# EAGLE design temp indicator (EAGLE 9.0.0)
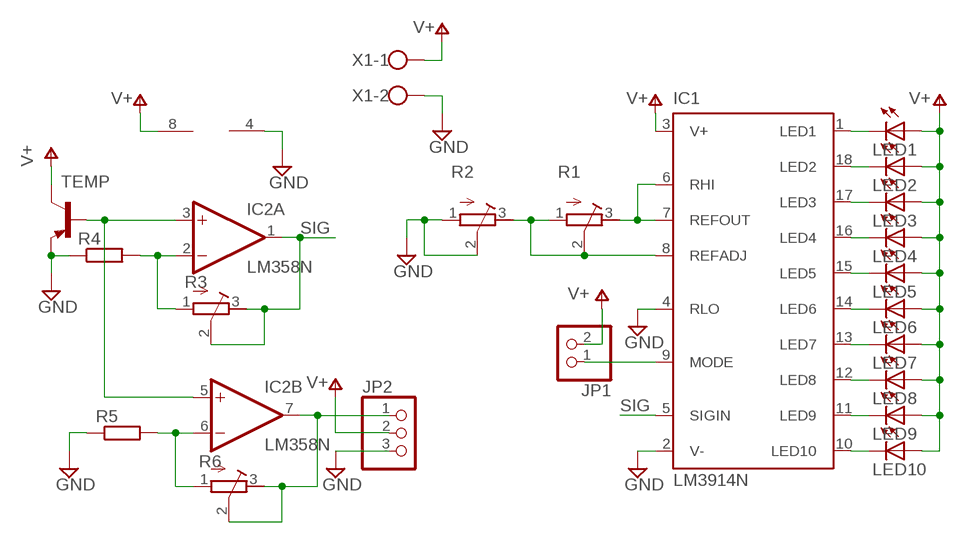
[diagram p0: schematic, sheet 1]

## Parts
IC1  LM3914N  [DIL18]
IC2  LM358N  [DIL08]
JP1  PINHD-1X2  [1X02]
JP2  PINHD-1X3  [1X03]
LED1  LED5MM  [LED5MM]
LED2  LED5MM  [LED5MM]
LED3  LED5MM  [LED5MM]
LED4  LED5MM  [LED5MM]
LED5  LED5MM  [LED5MM]
LED6  LED5MM  [LED5MM]
LED7  LED5MM  [LED5MM]
LED8  LED5MM  [LED5MM]
LED9  LED5MM  [LED5MM]
LED10  LED5MM  [LED5MM]
R1  R-TRIMM64W  [RTRIM64W]
R2  R-TRIMM64W  [RTRIM64W]
R3  R-TRIMM64W  [RTRIM64W]
R4  R-EU_0207/10  [0207/10]
R5  R-EU_0207/10  [0207/10]
R6  R-TRIMM64W  [RTRIM64W]
TEMP  BC557  [TO92-EBC]
X1  W237-102  [W237-102]

## Nets
GND: IC1.2(V-) IC1.4(RLO) IC2.4(P:V-) JP2.3 R2.1(A) R2.2(S) R4.1 R5.1 TEMP.E X1.2
N$1: IC1.1(LED1) LED1.K(C)
N$2: IC1.18(LED2) LED2.K(C)
N$3: IC1.17(LED3) LED3.K(C)
N$4: IC1.16(LED4) LED4.K(C)
N$5: IC1.15(LED5) LED5.K(C)
N$6: IC1.14(LED6) LED6.K(C)
N$7: IC1.13(LED7) LED7.K(C)
N$8: IC1.12(LED8) LED8.K(C)
N$9: IC1.11(LED9) LED9.K(C)
N$10: IC1.10(LED10) LED10.K(C)
N$11: IC1.6(RHI) IC1.7(REFOUT) R1.3(E)
N$12: IC1.9(MODE) JP1.1
N$13: IC1.8(REFADJ) R1.1(A) R1.2(S) R2.3(E)
N$14: IC2.7(B:OUT) JP2.1 R6.2(S) R6.3(E)
N$15: IC2.3(A:+IN) IC2.5(B:+IN) TEMP.B
N$16: IC2.2(A:-IN) R3.1(A) R4.2
N$18: IC2.6(B:-IN) R5.2 R6.1(A)
SIG: IC1.5(SIGIN) IC2.1(A:OUT) R3.2(S) R3.3(E)
V+: IC1.3(V+) IC2.8(P:V+) JP1.2 JP2.2 LED1.A LED2.A LED3.A LED4.A LED5.A LED6.A LED7.A LED8.A LED9.A LED10.A TEMP.C X1.1

## Library data of the parts
IC1 = national-semiconductor:LM391: Dot/Bar Display Driver Source: Data sheet LM3915 <http://www.national.com/ds/LM/LM3915.pdf> Data sheet LM3914 <http://www.national.com/ds/LM/LM3914.pdf>
IC2 = linear:LM358: OP AMP also LM158; LM258; LM2904 Source: http://cache.national.com/ds/LM/LM158.pdf
JP1 = pinhead:PINHD-1X2: PIN HEADER
JP2 = pinhead:PINHD-1X3: PIN HEADER
LED1-LED10 = led:LED: LED OSRAM: - CHIPLED LG R971, LG N971, LY N971, LG Q971, LY Q971, LO R971, LY R971 LH N974, LH R974 LS Q976, LO Q976, LY Q976 LO Q996 - Hyper CHIPLED LW Q18S LB Q993, LB Q99A, LB R99A - SideLED LS A670, LO A670, LY A670, LG A670, LP A670 LB A673, LV A673, LT A673, LW A673 LH A674 LY A675 LS A676, LA A676, LO A676, LY A676, LW A676 LS A679, LY A679, LG A679 - Hyper Micro SIDELED® LS Y876, LA Y876, LO Y876, LY Y876 LT Y87S - SmartLED LW L88C, LW L88S LB L89C, LB L89S, LG L890 LS L89K, LO L89K, LY L89K LS L896, LA L896, LO L896, LY L896 - TOPLED LS T670, LO T670, LY T670, LG T670, LP T670 LSG T670, LSP T670, LSY T670, LOP T670, LYG T670 LG T671, LOG T671, LSG T671 LB T673, LV T673, LT T673, LW T673 LH T674 LS T676, LA T676, LO T676, LY T676, LB T676, LH T676, LSB T676, LW T676 LB T67C, LV T67C, LT T67C, LS T67K, LO T67K, LY T67K, LW E67C LS E67B, LA E67B, LO E67B, LY E67B, LB E67C, LV E67C, LT E67C LW T67C LS T679, LY T679, LG T679 LS T770, LO T770, LY T770, LG T770, LP T770 LB T773, LV T773, LT T773, LW T773 LH T774 LS E675, LA E675, LY E675, LS T675 LS T776, LA T776, LO T776, LY T776, LB T776 LHGB T686 LT T68C, LB T68C - Hyper Mini TOPLED® LB M676 - Mini TOPLED Santana® LG M470 LS M47K, LO M47K, LY M47K Source: http://www.osram.convergy.de LUXEON: - LUMILED® LXK2-PW12-R00, LXK2-PW12-S00, LXK2-PW14-U00, LXK2-PW14-V00 LXK2-PM12-R00, LXK2-PM12-S00, LXK2-PM14-U00 LXK2-PE12-Q00, LXK2-PE12-R00, LXK2-PE12-S00, LXK2-PE14-T00, LXK2-PE14-U00 LXK2-PB12-K00, LXK2-PB12-L00, LXK2-PB12-M00, LXK2-PB14-N00, LXK2-PB14-P00, LXK2-PB14-Q00 LXK2-PR12-L00, LXK2-PR12-M00, LXK2-PR14-Q00, LXK2-PR14-R00 LXK2-PD12-Q00, LXK2-PD12-R00, LXK2-PD12-S00 LXK2-PH12-R00, LXK2-PH12-S00 LXK2-PL12-P00, LXK2-PL12-Q00, LXK2-PL12-R00 Source: www.luxeon.com KINGBRIGHT: KA-3528ASYC Source: www.kingbright.com
R1-R3 R6 = rcl:R-TRIMM: Trimm resistor; SPICEMODEL: X; SPICEPREFIXL: POT
R4 R5 = resistor:R-EU_: RESISTOR, European symbol
TEMP = transistor-pnp:BC557*: PNP Transistror
X1 = con-wago-500:W237-102: WAGO SCREW CLAMP; MPN: 237-102; OC_FARNELL: unknown; OC_NEWARK: 70K9898

## Board
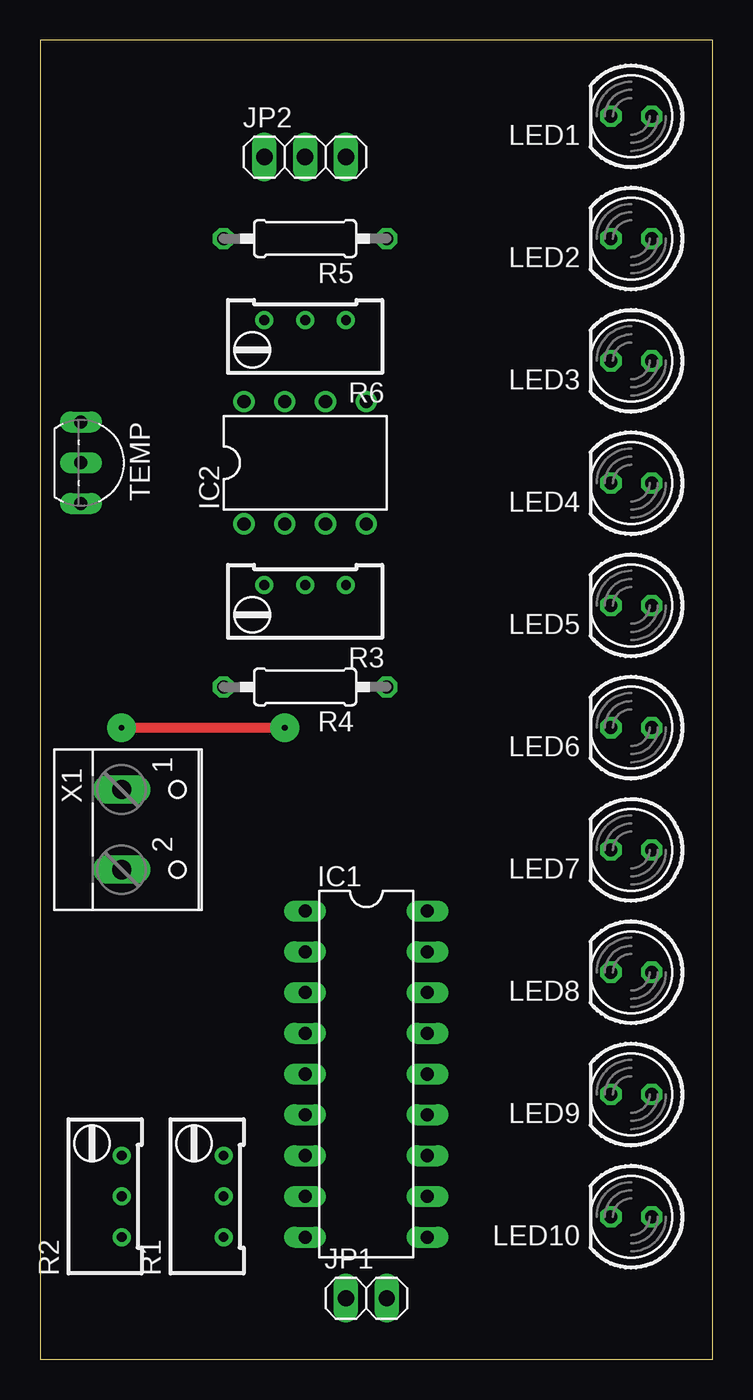
[diagram p1: board, top side]
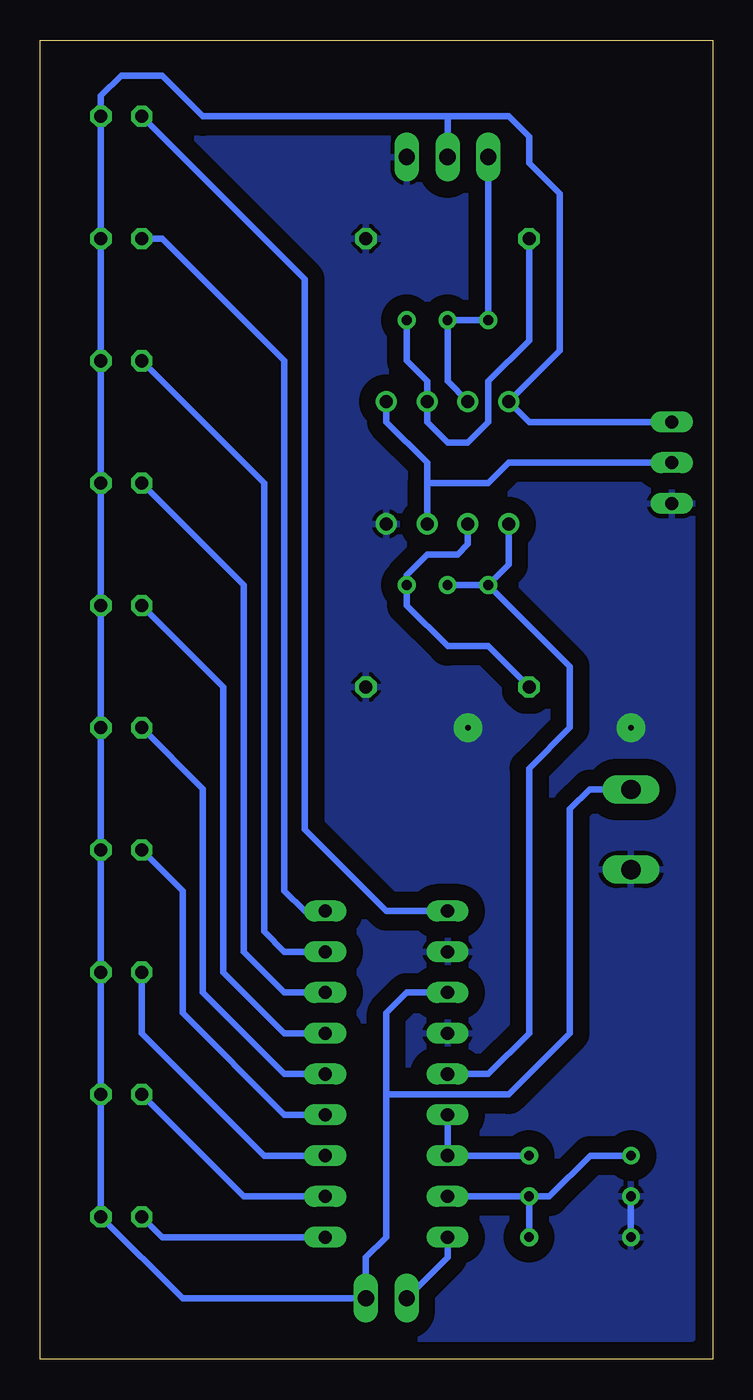
[diagram p2: board, bottom side, seen from below]

Size 41.89 x 82.22 mm. Coordinates in mm from the lower left corner, seen from the top.
Outline: 0,0 41.89,0 41.89,82.22 0,82.22 0,0
Copper layers (1*16): Top 0.035mm / dielectric 1.5mm / Bottom 0.035mm
Design rules "default": minimum track width 6mil, minimum drill 0.35mm, track to track 6mil, track to pad 6mil, pad to pad 6mil, via to via 6mil, smd to smd 6mil, copper to edge 40mil, drill to drill 6mil, minimum pad ring 10mil, minimum via ring 8mil, stop-mask expansion 4mil, vias tented up to drill 0mil, thermal gap 10mil

### Footprints (pad centres in the part's own frame; a part is rotated, then mirrored left to right if it is on the bottom)
DIL18 = drill 0.813 long: 1 -10.16,-3.81; 2 -7.62,-3.81; 3 -5.08,-3.81; 4 -2.54,-3.81; 5 0,-3.81; 6 2.54,-3.81; 7 5.08,-3.81; 8 7.62,-3.81; 9 10.16,-3.81; 10 10.16,3.81; 11 7.62,3.81; 12 5.08,3.81; 13 2.54,3.81; 14 0,3.81; 15 -2.54,3.81; 16 -5.08,3.81; 17 -7.62,3.81; 18 -10.16,3.81
DIL08 = drill 0.813 pad 1.27: 1 -3.81,-3.81; 2 -1.27,-3.81; 3 1.27,-3.81; 4 3.81,-3.81; 5 3.81,3.81; 6 1.27,3.81; 7 -1.27,3.81; 8 -3.81,3.81
1X02 = drill 1.016 long: 1 -1.27,0; 2 1.27,0
1X03 = drill 1.016 long: 1 -2.54,0; 2 0,0; 3 2.54,0
LED5MM = drill 0.813 octagon: A -1.27,0; K 1.27,0
RTRIM64W = drill 0.61: 1 1.27,-2.54; 2 1.27,0; 3 1.27,2.54
0207/10 = drill 0.813 octagon: 1 -5.08,0; 2 5.08,0
TO92-EBC = drill 0.813 long: B 0,-1.27; C -2.54,-1.27; E 2.54,-1.27
W237-102 = drill 1.194 long: 1 -2.5,-1.27; 2 2.5,-1.27

### Placement (x,y rotation side)
IC1  20.32,17.78 270 top
IC2  16.51,55.88 0 top
JP1  20.32,3.81 0 top
JP2  16.51,74.93 0 top
LED1  36.83,77.47 180 top
LED2  36.83,69.85 180 top
LED3  36.83,62.23 180 top
LED4  36.83,54.61 180 top
LED5  36.83,46.99 180 top
LED6  36.83,39.37 180 top
LED7  36.83,31.75 180 top
LED8  36.83,24.13 180 top
LED9  36.83,16.51 180 top
LED10  36.83,8.89 180 top
R1  10.16,10.16 0 top
R2  3.81,10.16 0 top
R3  16.51,46.99 90 top
R4  16.51,41.91 180 top
R5  16.51,69.85 180 top
R6  16.51,63.5 90 top
TEMP  3.81,55.88 270 top
X1  6.35,33.02 270 top

### Tracks (layer width: path | path; a pad name or v marks a point on that pad's centre or on a via)
GND  (via drill 0.35 pad 1.78)
  Top 0.61: v5.08,39.37 v15.24,39.37
  Bottom 0.406: R2.2 R2.1
  pour Bottom (isolate 1.016): 1.27,81.28 1.27,1.27 40.64,1.27 40.64,81.28
N$1
  Bottom 0.406: IC1.1 20.32,27.94 25.4,33.02 25.4,67.31 LED1.K
N$2
  Bottom 0.406: LED2.K 34.29,69.85 26.67,62.23 26.67,29.21 25.4,27.94 IC1.18
N$3
  Bottom 0.406: IC1.17 26.67,25.4 27.94,26.67 27.94,54.61 LED3.K
N$4
  Bottom 0.406: IC1.16 26.67,22.86 29.21,25.4 29.21,48.26 LED4.K
N$5
  Bottom 0.406: IC1.15 26.67,20.32 30.48,24.13 30.48,41.91 LED5.K
N$6
  Bottom 0.406: IC1.14 26.67,17.78 31.75,22.86 31.75,35.56 LED6.K
N$7
  Bottom 0.406: IC1.13 26.67,15.24 33.02,21.59 33.02,29.21 LED7.K
N$8
  Bottom 0.406: IC1.12 27.94,12.7 35.56,20.32 LED8.K
N$9
  Bottom 0.406: IC1.11 29.21,10.16 LED9.K
N$10
  Bottom 0.406: IC1.10 34.29,7.62 LED10.K
N$11
  Bottom 0.406: R1.3 IC1.7 IC1.6
N$12
  Bottom 0.406: IC1.9 16.51,6.35 JP1.1
N$13
  Bottom 0.406: R1.2 R1.1 | R1.2 IC1.8 | R1.2 10.16,10.16 7.62,12.7 R2.3
N$14
  Bottom 0.406: IC2.7 16.51,60.96 R6.2 R6.3 JP2.1
N$15
  Bottom 0.406: IC2.3 17.78,54.61 | 17.78,54.61 13.97,54.61 12.7,55.88 TEMP.B | 17.78,54.61 17.78,55.88 20.32,58.42 IC2.5
N$16
  Bottom 0.406: IC2.2 15.24,50.8 15.88,50.16 17.78,50.16 19.05,48.89 R3.1 19.05,46.99 16.51,44.45 13.97,44.45 R4.2
N$18
  Bottom 0.406: R6.1 19.05,62.23 17.78,60.96 IC2.6 17.78,58.42 16.51,57.15 15.24,57.15 13.97,58.42 13.97,60.96 11.43,63.5 R5.2
SIG
  Bottom 0.406: R3.3 R3.2 | R3.3 12.7,49.53 IC2.1 | 15.24,17.78 IC1.5 13.97,17.78 11.43,20.32 11.43,36.83 8.89,39.37 8.89,43.18 R3.3
V+
  Bottom 0.406: 16.51,77.47 12.7,77.47 11.43,76.2 11.43,74.55 9.52,72.64 9.52,62.86 IC2.8 11.43,58.42 TEMP.C | 16.51,76.2 JP2.2 16.51,77.47 | 16.51,77.47 31.75,77.47 34.29,80.01 36.83,80.01 38.1,78.74 LED1.A LED2.A LED3.A LED4.A LED5.A LED6.A LED7.A LED8.A LED9.A LED10.A 33.02,3.81 JP1.2 21.59,6.35 20.32,7.62 20.32,16.51 | 20.32,16.51 20.32,21.59 19.05,22.86 IC1.3 | 3.77,35.52 X1.1 7.66,35.52 8.89,34.29 8.89,20.32 12.7,16.51 20.32,16.51